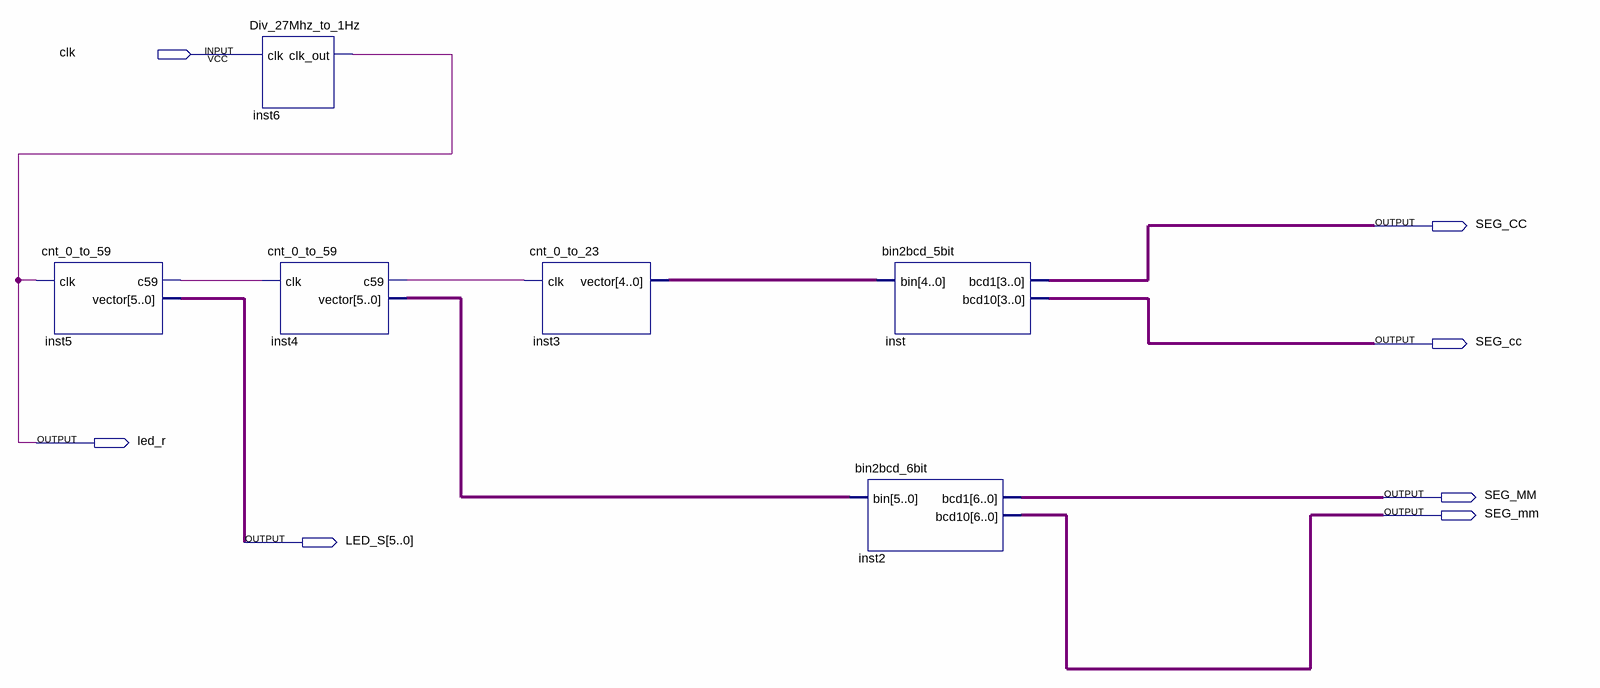
[diagram p0: schematic sheet]
// Quartus schematic time.bdf as structural Verilog: 6 symbols, 7 pins
module \time  (
  input  clk,
  output SEG_cc,
  output led_r,
  output SEG_mm,
  output [5:0] LED_S
);

  wire inst4_c59, inst5_c59;
  wire [3:0] inst_bcd1, inst_bcd10;
  wire [4:0] inst3_vector;
  wire [5:0] inst4_vector;
  wire [6:0] inst2_bcd1, inst2_bcd10;

  cnt_0_to_59 inst5 (.clk(led_r), .c59(inst5_c59), .vector(LED_S));
  Div_27Mhz_to_1Hz inst6 (.clk(clk), .clk_out(led_r));
  cnt_0_to_59 inst4 (.clk(inst5_c59), .c59(inst4_c59), .vector(inst4_vector));
  cnt_0_to_23 inst3 (.clk(inst4_c59), .vector(inst3_vector));
  bin2bcd_5bit inst (.bin(inst3_vector), .bcd1(inst_bcd1), .bcd10(inst_bcd10));
  bin2bcd_6bit inst2 (.bin(inst4_vector), .bcd1(inst2_bcd1), .bcd10(inst2_bcd10));
endmodule
